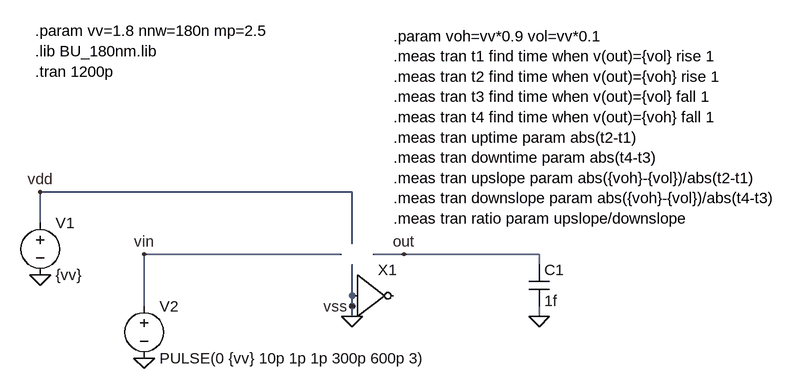
[diagram p0: schematic inv_test.asc]
inv_test.asc, the LTspice schematic file:
Version 4
SHEET 1 1168 680
WIRE 416 224 -64 224
WIRE -64 272 -64 224
WIRE 416 304 416 224
WIRE 400 320 96 320
WIRE 496 320 448 320
WIRE 704 320 496 320
WIRE 704 336 704 320
WIRE 96 400 96 320
WIRE 416 400 416 336
WIRE 416 416 416 400
WIRE 704 416 704 400
FLAG -64 352 0
FLAG 96 480 0
FLAG 416 416 0
FLAG -64 224 vdd
FLAG 416 400 vss
FLAG 96 320 vin
FLAG 496 320 out
FLAG 704 416 0
SYMBOL /voltage -64 256 R0
SYMATTR InstName V1
SYMATTR Value {vv}
SYMBOL /voltage 96 384 R0
SYMATTR InstName V2
SYMATTR Value PULSE(0 {vv} 10p 1p 1p 300p 600p 3)
SYMBOL inv 416 320 R0
SYMATTR InstName X1
SYMATTR SpiceLine ll=180n wn={nnw} wp={nnw*mp}
SYMBOL /cap 688 336 R0
SYMATTR InstName C1
SYMATTR Value 1f
TEXT -72 -24 Left 2 !.param vv=1.8 nnw=180n mp=2.5\n.lib BU_180nm.lib\n.tran 1200p
TEXT 480 -16 Left 2 !.param voh=vv*0.9 vol=vv*0.1\n.meas tran t1 find time when v(out)={vol} rise 1\n.meas tran t2 find time when v(out)={voh} rise 1\n.meas tran t3 find time when v(out)={vol} fall 1\n.meas tran t4 find time when v(out)={voh} fall 1\n.meas tran uptime param abs(t2-t1)\n.meas tran downtime param abs(t4-t3)\n.meas tran upslope param abs({voh}-{vol})/abs(t2-t1)\n.meas tran downslope param abs({voh}-{vol})/abs(t4-t3)\n.meas tran ratio param upslope/downslope

The netlist it stands for:
* inv_test.asc
V1 vdd 0 {vv}
V2 vin 0 PULSE(0 {vv} 10p 1p 1p 300p 600p 3)
A§X1 0 0 0 0 0 0 0 0 BUF ll=180n wn={nnw} wp={nnw*mp}
C1 out 0 1f
.param vv=1.8 nnw=180n mp=2.5
.lib BU_180nm.lib
.tran 1200p
.param voh=vv*0.9 vol=vv*0.1
.meas tran t1 find time when v(out)={vol} rise 1
.meas tran t2 find time when v(out)={voh} rise 1
.meas tran t3 find time when v(out)={vol} fall 1
.meas tran t4 find time when v(out)={voh} fall 1
.meas tran uptime param abs(t2-t1)
.meas tran downtime param abs(t4-t3)
.meas tran upslope param abs({voh}-{vol})/abs(t2-t1)
.meas tran downslope param abs({voh}-{vol})/abs(t4-t3)
.meas tran ratio param upslope/downslope
.backanno
.end